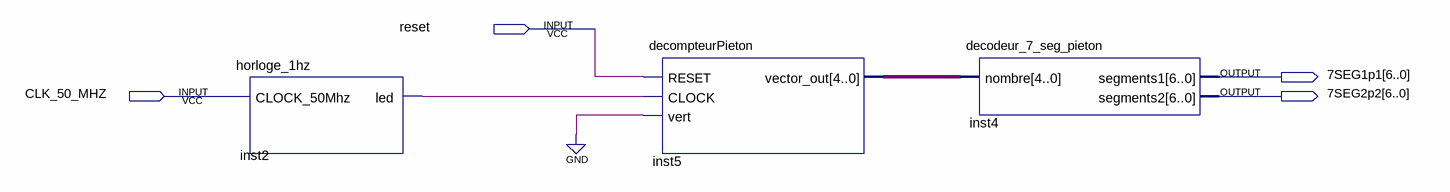
[diagram p0: schematic sheet]
// Quartus schematic testUnitDecompteurPieton.bdf as structural Verilog: 3 symbols, 4 pins
module testUnitDecompteurPieton (
  input  reset,
  input  CLK_50_MHZ,
  output [6:0] \7SEG1p1 ,
  output [6:0] \7SEG2p2 
);

  wire inst2_led;
  wire [4:0] inst5_vector_out;

  horloge_1hz inst2 (.CLOCK_50Mhz(CLK_50_MHZ), .led(inst2_led));
  decompteurPieton inst5 (.RESET(reset), .CLOCK(inst2_led), .vert(1'b0), .vector_out(inst5_vector_out));
  decodeur_7_seg_pieton inst4 (.nombre(inst5_vector_out), .segments1(\7SEG1p1 ), .segments2(\7SEG2p2 ));
endmodule
